# EAGLE schematic PIC18F14K50 USB (EAGLE 6.4)
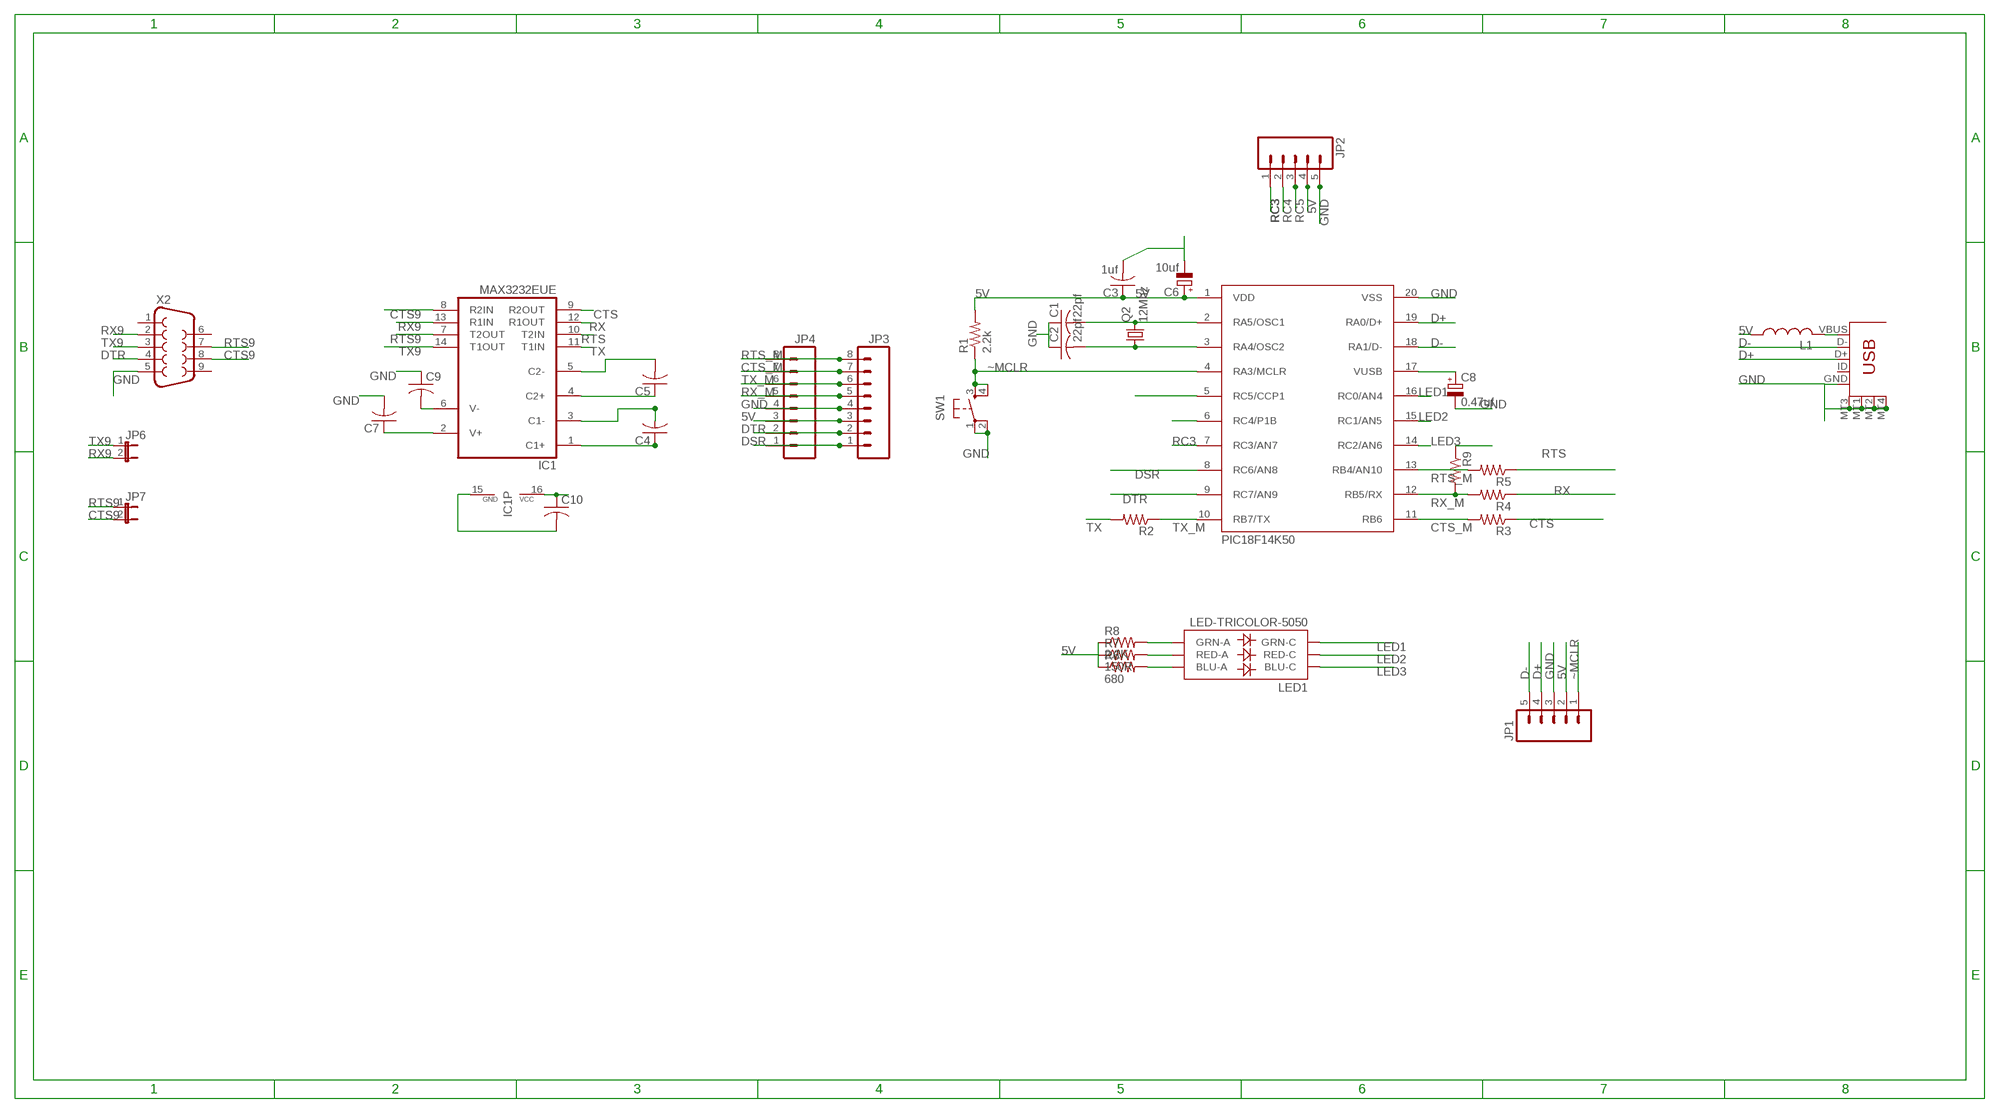
[diagram p0: schematic, sheet 1]

## Parts
C1  22pf  C-USC0805  [C0805]
C2  22pf  C-USC0805  [C0805]
C3  1uf  C-USC0805  [C0805]
C4  C-USC0805  [C0805]
C5  C-USC0805  [C0805]
C6  10uf  CAP_POLSMC_B  [SMC_B]
C7  C-USC0805  [C0805]
C8  0.47uf  CAP_POLSMC_B  [SMC_B]
C9  C-USC0805  [C0805]
C10  C-USC0805  [C0805]
IC1  MAX3232EUE  [TSSOP16]
JP1  M05PTH  [1X05]
JP2  M05PTH  [1X05]
JP3  M081X08  [1X08]
JP4  M081X08  [1X08]
JP6  JUMPER-2PTH  [1X02]
JP7  JUMPER-2PTH  [1X02]
L1  L-USL3225M  [L3225M]
LED1  LED-TRICOLOR-5050  [LED-TRICOLOR-5050]
PIC18F14K50  PIC18F14K50D  [SSOP20]
Q2  12Mhz  CRYSTALHC49UP  [HC49UP]
R1  2.2k  R-US_M0805  [M0805]
R2  R-US_M0805  [M0805]
R3  R-US_M0805  [M0805]
R4  R-US_M0805  [M0805]
R5  R-US_M0805  [M0805]
R6  680  R-US_M0805  [M0805]
R7  150R  R-US_M0805  [M0805]
R8  2.2K  R-US_M0805  [M0805]
R9  R-US_M0805  [M0805]
SW1  SW-SMD-SMALL  [TACT_SWITCH_SMALL]
U$1  USB-MICROB-HW-MC-5F  [USB-MICROB-HW-MC-5F-01]
X2  F09D  [F09D]

## Nets
5V: C3.1 C6.+ C10.1 IC1.16(VCC) JP1.2 JP2.4 JP3.3 JP4.3 L1.1 PIC18F14K50.1(VDD) R1.2 R6.1 R7.1 R8.1 R9.1
CTS: IC1.9(R2OUT) R3.1
CTS9: IC1.8(R2IN) JP7.2 X2.8
CTS_M: JP3.7 JP4.7 PIC18F14K50.11(RB6) R3.2
D+: JP1.4 PIC18F14K50.19(RA0/D+) U$1.D+
D-: JP1.5 PIC18F14K50.18(RA1/D-) U$1.D-
DSR: JP3.1 JP4.1 PIC18F14K50.8(RC6/AN8)
DTR: JP3.2 JP4.2 PIC18F14K50.9(RC7/AN9) X2.4
GND: C1.1 C2.1 C3.2 C6.- C7.2 C8.- C9.1 C10.2 IC1.15(GND) JP1.3 JP2.5 JP3.4 JP4.4 PIC18F14K50.20(VSS) SW1.1 SW1.2 U$1.GND U$1.MT1(MTN3) U$1.MT2(MTN4) U$1.MT3(MTN1) U$1.MT4(MTN2) X2.5
LED1: LED1.3(GRN-C) PIC18F14K50.16(RC0/AN4)
LED2: LED1.2(RED-C) PIC18F14K50.15(RC1/AN5)
LED3: LED1.1(BLU-C) PIC18F14K50.14(RC2/AN6)
N$1: C2.2 PIC18F14K50.3(RA4/OSC2) Q2.1
N$2: C1.2 PIC18F14K50.2(RA5/OSC1) Q2.2
N$13: LED1.6(BLU-A) R6.2
N$18: LED1.5(RED-A) R7.2
N$19: LED1.4(GRN-A) R8.2
N$20: C4.1 IC1.1(C1+)
N$21: C4.2 IC1.3(C1-)
N$22: C5.1 IC1.4(C2+)
N$23: C5.2 IC1.5(C2-)
N$24: C7.1 IC1.2(V+)
N$25: C9.2 IC1.6(V-)
N$55: C8.+ PIC18F14K50.17(VUSB)
RC3: JP2.1 PIC18F14K50.7(RC3/AN7)
RC4: JP2.2 PIC18F14K50.6(RC4/P1B)
RC5: JP2.3 PIC18F14K50.5(RC5/CCP1)
RTS: IC1.10(T2IN) R5.1
RTS9: IC1.7(T2OUT) JP7.1 X2.7
RTS_M: JP3.8 JP4.8 PIC18F14K50.13(RB4/AN10) R5.2
RX: IC1.12(R1OUT) R4.1
RX9: IC1.13(R1IN) JP6.2 X2.2
RX_M: JP3.5 JP4.5 PIC18F14K50.12(RB5/RX) R4.2 R9.2
TX: IC1.11(T1IN) R2.2
TX9: IC1.14(T1OUT) JP6.1 X2.3
TX_M: JP3.6 JP4.6 PIC18F14K50.10(RB7/TX) R2.1
VBUS5V: L1.2 U$1.VBUS
~MCLR: JP1.1 PIC18F14K50.4(RA3/MCLR) R1.1 SW1.3 SW1.4
Unconnected: U$1.ID X2.1 X2.6 X2.9

## Library data of the parts
C1-C5 C7 C9 C10 = rcl:C-US: CAPACITOR, American symbol
C6 C8 = dp_devices:CAP_POL
IC1 = maxim:MAX3232*: True RS-232 Transceivers 3.0V to 5.5V, Low-Power up to 1Mbps, Using Four 0.1µF External Capacitors Source: http://pdfserv.maxim-ic.com/en/ds/MAX3222-MAX3241.pdf; MF: MAXIM; MPN: MAX3232EUE+; OC_FARNELL: 1379769; OC_NEWARK: 68K4632
JP1 JP2 = SparkFun:M05: Header 5 Standard 5-pin 0.1" header. Use with straight break away headers (SKU : PRT-00116), right angle break away headers (PRT-00553), swiss pins (PRT-00743), machine pins (PRT-00117), and female headers (PRT-00115). Molex polarized connector foot print use with SKU : PRT-08230 with associated crimp pins and housings.
JP3 JP4 = SparkFun:M08: Header 8 Standard 8-pin 0.1" header. Use with straight break away headers (SKU : PRT-00116), right angle break away headers (PRT-00553), swiss pins (PRT-00743), machine pins (PRT-00117), and female headers (PRT-00115).
JP6 JP7 = SparkFun:JUMPER-2: Jumper Basic 0.1" spaced jumper. Use with breakaway headers.
L1 = rcl:L-US: INDUCTOR, American symbol
LED1 = SparkFun:LED-TRICOLOR-5050
PIC18F14K50 = pic18f14k50:PIC18F14K50: 20-Pin USB Flash Microcontrollers PIC18F14K50
Q2 = crystal:CRYSTAL: CRYSTAL; OC_FARNELL: unknown; OC_NEWARK: unknown
R1-R9 = rcl:R-US_: RESISTOR, American symbol
SW1 = dp_devices:SW-SMD-SMALL
U$1 = SparkFun:USB-MICROB-HW-MC-5F
X2 = con-subd:F09: SUB-D; OC_FARNELL: unknown; OC_NEWARK: unknown